# EAGLE design radio_V14.01.09 (EAGLE 5.01)
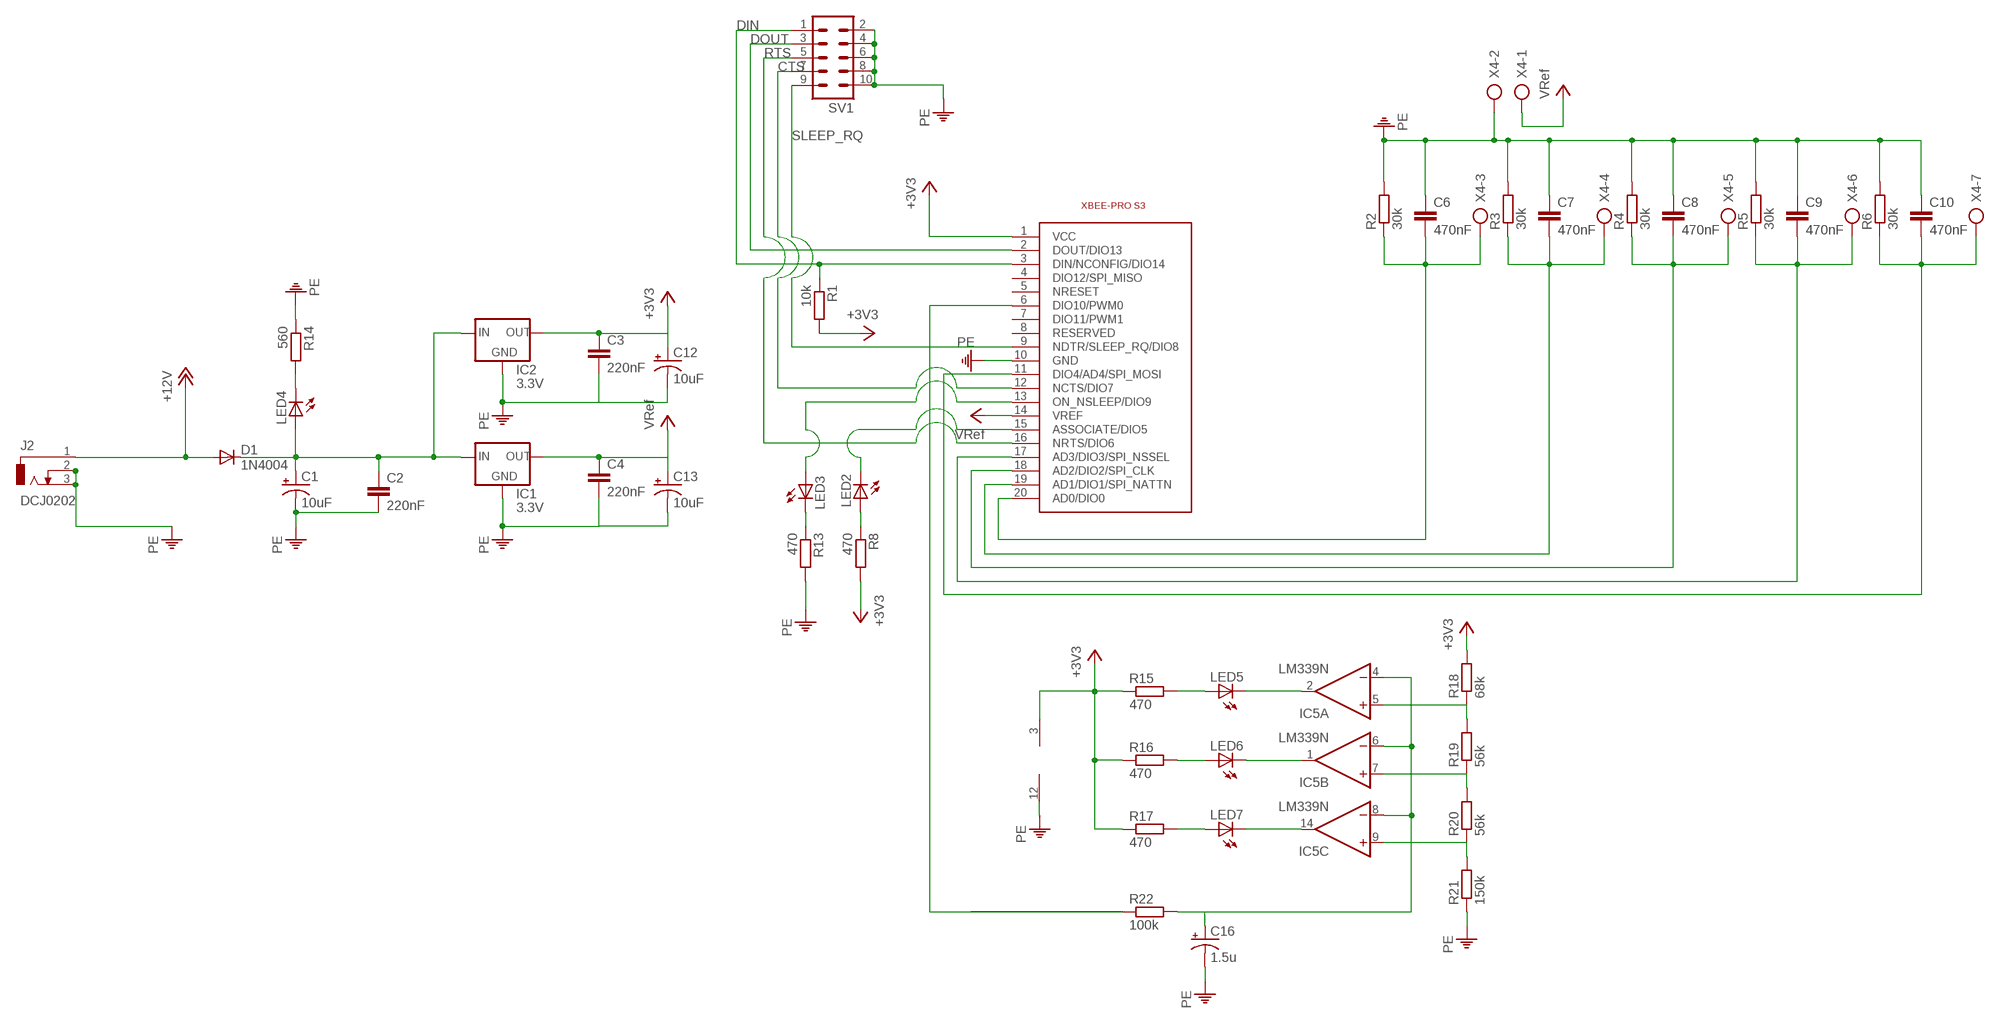
[diagram p0: schematic, sheet 1]

## Parts
C1  10uF  CPOL-USE2-5  [E2-5]
C2  220nF  C5/3.5  [C5B3.5]
C3  220nF  C5/3.5  [C5B3.5]
C4  220nF  C5/3.5  [C5B3.5]
C6  470nF  C5/3.5  [C5B3.5]
C7  470nF  C5/3.5  [C5B3.5]
C8  470nF  C5/3.5  [C5B3.5]
C9  470nF  C5/3.5  [C5B3.5]
C10  470nF  C5/3.5  [C5B3.5]
C12  10uF  CPOL-USE2-5  [E2-5]
C13  10uF  CPOL-USE2-5  [E2-5]
C16  1.5u  CPOL-USE2-5  [E2-5]
D1  1N4004  [DO41-10]
IC1  3.3V  78XXL  [78XXL]
IC2  3.3V  78XXL  [78XXL]
IC5  LM339N  [DIL14]
J2  DCJ0202  [DCJ0202]
LED2  LED3MM  [LED3MM]
LED3  LED3MM  [LED3MM]
LED4  LED5MM  [LED5MM]
LED5  LED3MM  [LED3MM]
LED6  LED3MM  [LED3MM]
LED7  LED3MM  [LED3MM]
R1  10k  R-EU_0207/7  [0207/7]
R2  30k  R-EU_0207/7  [0207/7]
R3  30k  R-EU_0207/7  [0207/7]
R4  30k  R-EU_0207/7  [0207/7]
R5  30k  R-EU_0207/7  [0207/7]
R6  30k  R-EU_0207/7  [0207/7]
R8  470  R-EU_0207/7  [0207/7]
R13  470  R-EU_0207/7  [0207/7]
R14  560  R-EU_0207/7  [0207/7]
R15  470  R-EU_0207/7  [0207/7]
R16  470  R-EU_0207/7  [0207/7]
R17  470  R-EU_0207/7  [0207/7]
R18  68k  R-EU_0207/7  [0207/7]
R19  56k  R-EU_0207/7  [0207/7]
R20  56k  R-EU_0207/7  [0207/7]
R21  150k  R-EU_0207/7  [0207/7]
R22  100k  R-EU_0207/7  [0207/7]
SV1  ML10  [ML10]
U$1  XBEEPRO900  [XBEE-PRO]
X4  AK500/8-H  [AK500/8-H]

## Nets
+3V3: C3.1 C12.+ IC2.OUT IC5.3(P:V+) R1.2 R8.2 R15.1 R16.1 R17.1 R18.2 U$1.1(VCC)
+12V: D1.A J2.1
CTS: SV1.7 U$1.12(NCTS/DIO7)
DIN: R1.1 SV1.1 U$1.3(DIN/NCONFIG/DIO14)
DOUT: SV1.3 U$1.2(DOUT/DIO13)
N$2: C1.+ C2.1 D1.C IC1.IN IC2.IN LED4.A
N$3: C6.2 R2.1 U$1.20(AD0/DIO0) X4.3
N$4: C7.2 R3.1 U$1.19(AD1/DIO1/SPI_NATTN) X4.4
N$5: C8.2 R4.1 U$1.18(AD2/DIO2/SPI_CLK) X4.5
N$6: C9.2 R5.1 U$1.17(AD3/DIO3/SPI_NSSEL) X4.6
N$7: C10.2 R6.1 U$1.11(DIO4/AD4/SPI_MOSI) X4.7
N$8: LED3.A U$1.13(ON_NSLEEP/DIO9)
N$9: R22.1 U$1.6(DIO10/PWM0)
N$11: LED2.A R8.1
N$14: LED3.K(C) R13.1
N$15: LED4.K(C) R14.2
N$16: LED2.K(C) U$1.15(ASSOCIATE/DIO5)
N$24: IC5.2(A:OUT) LED5.K(C)
N$25: IC5.1(B:OUT) LED6.K(C)
N$26: IC5.14(C:OUT) LED7.K(C)
N$27: LED7.A R17.2
N$28: LED6.A R16.2
N$29: LED5.A R15.2
N$30: IC5.5(A:+IN) R18.1 R19.2
N$31: IC5.7(B:+IN) R19.1 R20.2
N$32: IC5.9(C:+IN) R20.1 R21.2
N$33: C16.+ IC5.4(A:-IN) IC5.6(B:-IN) IC5.8(C:-IN) R22.2
PE: C1.- C2.2 C3.2 C4.2 C6.1 C7.1 C8.1 C9.1 C10.1 C12.- C13.- C16.- IC1.GND IC2.GND IC5.12(P:GND) J2.2 J2.3 R2.2 R3.2 R4.2 R5.2 R6.2 R13.2 R14.1 R21.1 SV1.2 SV1.4 SV1.6 SV1.8 SV1.10 U$1.10(GND) X4.2
RTS: SV1.5 U$1.16(NRTS/DIO6)
SLEEP_RQ: SV1.9 U$1.9(NDTR/SLEEP_RQ/DIO8)
VCC: C4.1 C13.+ IC1.OUT U$1.14(VREF) X4.1 ; supply symbol labelled VRef
Unconnected: IC5.10(D:-IN) IC5.11(D:+IN) IC5.13(D:OUT) U$1.4(DIO12/SPI_MISO) U$1.5(NRESET) U$1.7(DIO11/PWM1) U$1.8(RESERVED) X4.8

## Library data of the parts
C1 C12 C13 C16 = rcl:CPOL-US: POLARIZED CAPACITOR, American symbol
C2-C4 C6-C10 = capacitor-wima:C: CAPACITOR naming: grid - package width
D1 = diode:1N4004: DIODE general purpose rectifier, 1 A
IC1 IC2 = v-reg:78XXL: VOLTAGE REGULATOR
IC5 = linear:LM339: Low Power Low Offset Voltage Quad Comparators with open collector; LM139/LM239/LM339/LM2901/LM3302
J2 = con-jack:DCJ0202: DC POWER JACK Source: DCJ0202.pdf
LED2-LED7 = led:LED: LED OSRAM: - CHIPLED LG R971, LG N971, LY N971, LG Q971, LY Q971, LO R971, LY R971 LH N974, LH R974 LS Q976, LO Q976, LY Q976 LO Q996 - Hyper CHIPLED LW Q18S LB Q993, LB Q99A, LB R99A - SideLED LS A670, LO A670, LY A670, LG A670, LP A670 LB A673, LV A673, LT A673, LW A673 LH A674 LY A675 LS A676, LA A676, LO A676, LY A676, LW A676 LS A679, LY A679, LG A679 - Hyper Micro SIDELED® LS Y876, LA Y876, LO Y876, LY Y876 LT Y87S - SmartLED LW L88C, LW L88S LB L89C, LB L89S, LG L890 LS L89K, LO L89K, LY L89K LS L896, LA L896, LO L896, LY L896 - TOPLED LS T670, LO T670, LY T670, LG T670, LP T670 LSG T670, LSP T670, LSY T670, LOP T670, LYG T670 LG T671, LOG T671, LSG T671 LB T673, LV T673, LT T673, LW T673 LH T674 LS T676, LA T676, LO T676, LY T676, LB T676, LH T676, LSB T676, LW T676 LB T67C, LV T67C, LT T67C, LS T67K, LO T67K, LY T67K, LW E67C LS E67B, LA E67B, LO E67B, LY E67B, LB E67C, LV E67C, LT E67C LW T67C LS T679, LY T679, LG T679 LS T770, LO T770, LY T770, LG T770, LP T770 LB T773, LV T773, LT T773, LW T773 LH T774 LS E675, LA E675, LY E675, LS T675 LS T776, LA T776, LO T776, LY T776, LB T776 LHGB T686 LT T68C, LB T68C - Hyper Mini TOPLED® LB M676 - Mini TOPLED Santana® LG M470 LS M47K, LO M47K, LY M47K Source: http://www.osram.convergy.de - LUMILED® LXK2-PW12-R00, LXK2-PW12-S00, LXK2-PW14-U00, LXK2-PW14-V00 LXK2-PM12-R00, LXK2-PM12-S00, LXK2-PM14-U00 LXK2-PE12-Q00, LXK2-PE12-R00, LXK2-PE12-S00, LXK2-PE14-T00, LXK2-PE14-U00 LXK2-PB12-K00, LXK2-PB12-L00, LXK2-PB12-M00, LXK2-PB14-N00, LXK2-PB14-P00, LXK2-PB14-Q00 LXK2-PR12-L00, LXK2-PR12-M00, LXK2-PR14-Q00, LXK2-PR14-R00 LXK2-PD12-Q00, LXK2-PD12-R00, LXK2-PD12-S00 LXK2-PH12-R00, LXK2-PH12-S00 LXK2-PL12-P00, LXK2-PL12-Q00, LXK2-PL12-R00 Source: www.luxeon.com
R1-R6 R8 R13-R22 = resistor:R-EU_: RESISTOR, European symbol
SV1 = con-harting-ml:ML10: HARTING
U$1 = maxstream2:XBEEPRO900
X4 = con-ptr500:AK500/8-H: CONNECTOR Aug. 2004 / PTR Meßtechnik: Die Bezeichnung der Serie AK505 wurde geändert. Es handelt sich hierbei um AK500 in horizontaler Ausführung.

## Board
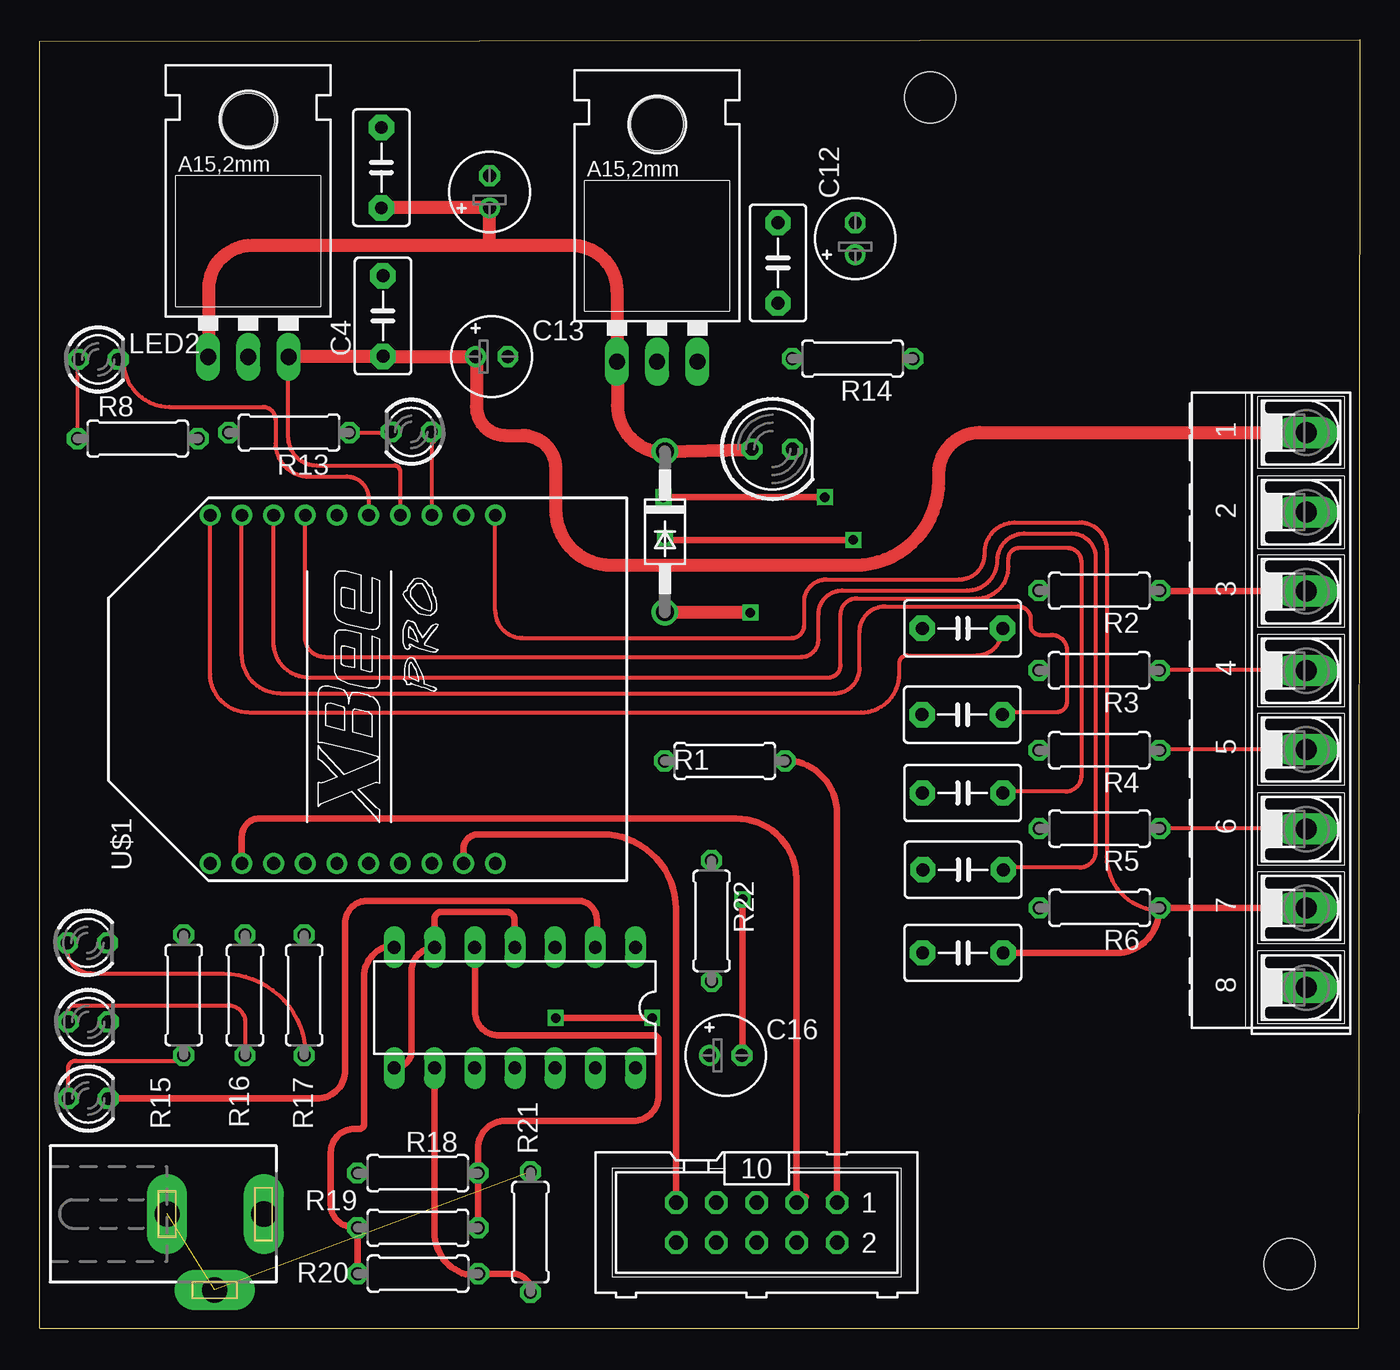
[diagram p1: board, top side]
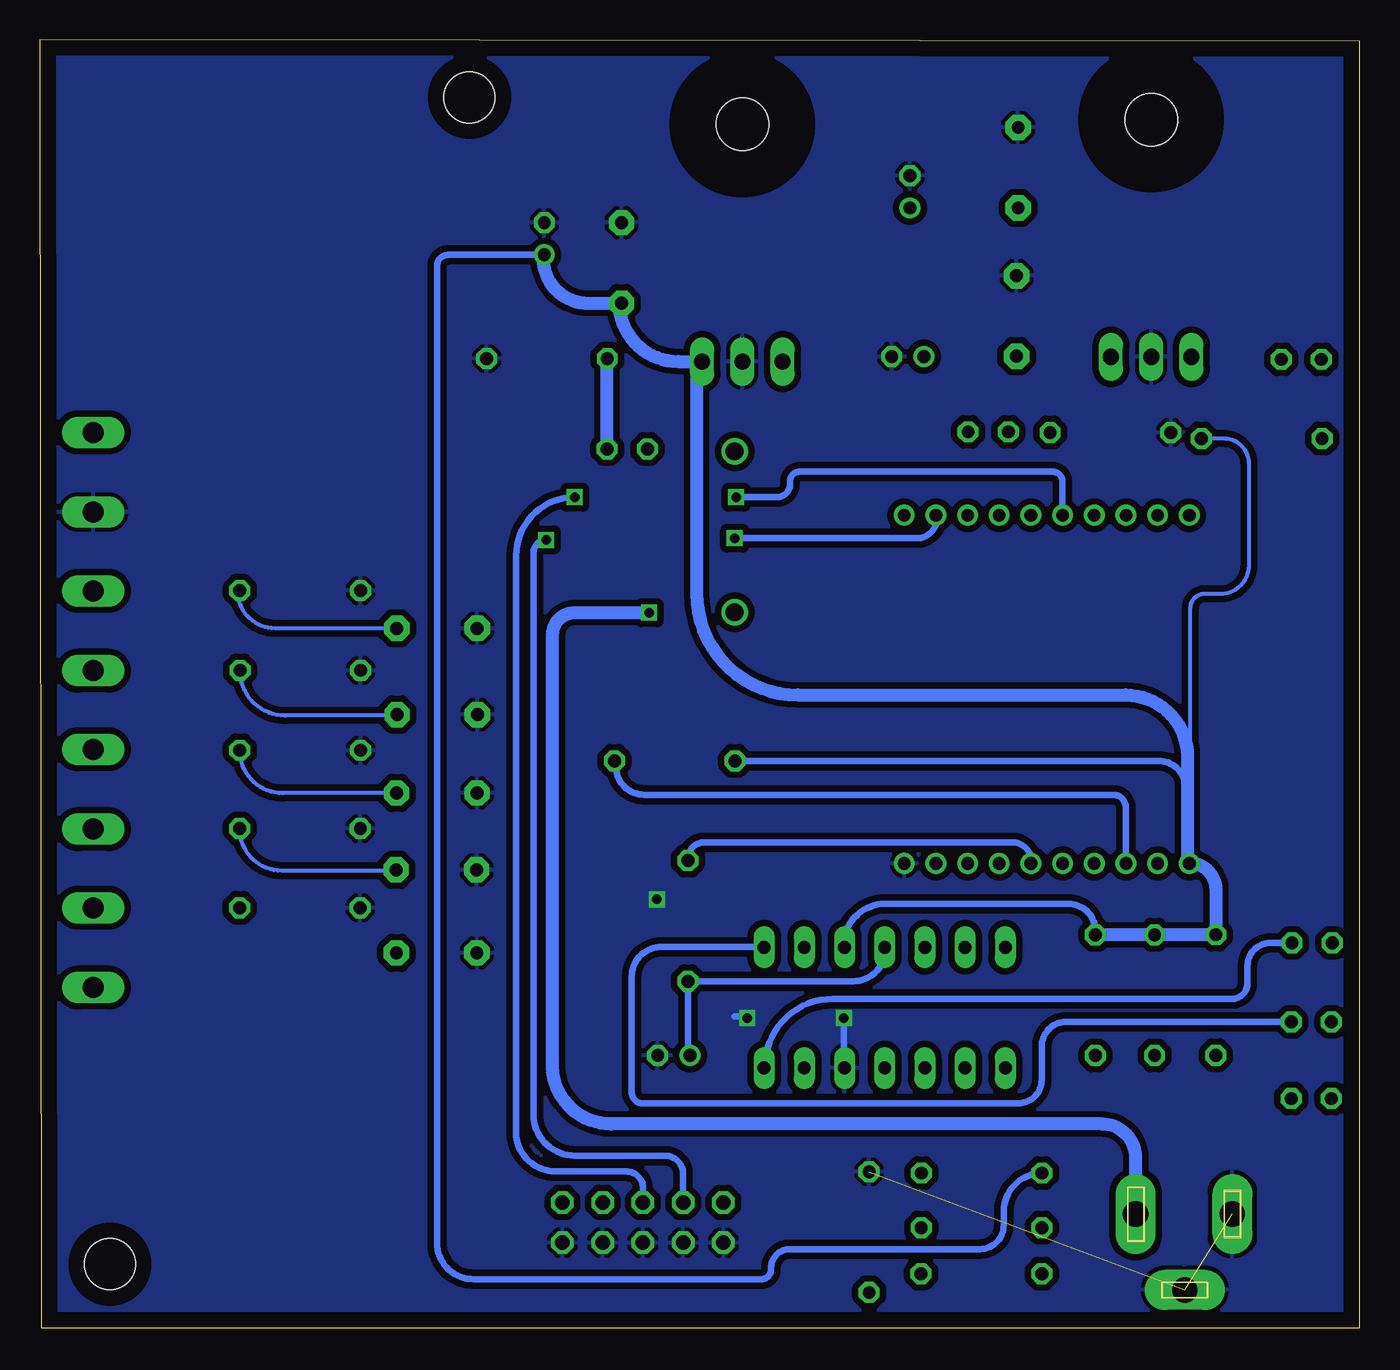
[diagram p2: board, bottom side, seen from below]

Size 83.4 x 81.4 mm. Coordinates in mm from the lower left corner, seen from the top.
Outline: 0,0 0,81.3 83.4,81.4 83.3,0 0,0
Outline: 7.5,8.7 8.6,8.7 8.6,5.7 7.5,5.7 7.5,8.7
Outline: 13.6,8.9 14.7,8.9 14.7,5.5 13.6,5.5 13.6,8.9
Outline: 9.6,1.9 12.5,1.9 12.5,2.9 9.6,2.9 9.6,1.9
Copper layers (1*16): Top 0.035mm / dielectric 1.5mm / Bottom 0.035mm
Design rules "default": minimum track width 10mil, minimum drill 24mil, track to track 8mil, track to pad 8mil, pad to pad 8mil, via to via 8mil, smd to smd 8mil, copper to edge 40mil, drill to drill 8mil, minimum pad ring 10mil, minimum via ring 8mil, stop-mask expansion 4mil, vias tented up to drill 0mil, thermal gap 10mil
Holes 3.2 mm at 78.95,4.05 56.25,77.75

### Footprints (pad centres in the part's own frame; a part is rotated, then mirrored left to right if it is on the bottom)
E2-5 = drill 0.813 pad 1.27 round: + -1.016,0 | drill 0.813 pad 1.27 octagon: - 1.016,0
C5B3.5 = drill 0.813 pad 1.6 octagon: 1 -2.54,0; 2 2.54,0
DO41-10 = drill 1.118 round: A 5.08,0; C -5.08,0
78XXL = drill 1.016 long: GND 0,-3.81; IN -2.54,-3.81; OUT 2.54,-3.81 | hole 3.302: 0,11.176
DIL14 = drill 0.813 long: 1 -7.62,-3.81; 2 -5.08,-3.81; 3 -2.54,-3.81; 4 0,-3.81; 5 2.54,-3.81; 6 5.08,-3.81; 7 7.62,-3.81; 8 7.62,3.81; 9 5.08,3.81; 10 2.54,3.81; 11 0,3.81; 12 -2.54,3.81; 13 -5.08,3.81; 14 -7.62,3.81
DCJ0202 = drill 1.6 pad 2.54 long: 1 0,3.1; 2 4.8,0; 3 0,-3
LED3MM = drill 0.813 octagon: A -1.27,0; K 1.27,0
LED5MM = drill 0.813 octagon: A -1.27,0; K 1.27,0
0207/7 = drill 0.813 octagon: 1 -3.81,0; 2 3.81,0
ML10 = drill 0.914 octagon: 1 -5.08,-1.27; 2 -5.08,1.27; 3 -2.54,-1.27; 4 -2.54,1.27; 5 0,-1.27; 6 0,1.27; 7 2.54,-1.27; 8 2.54,1.27; 9 5.08,-1.27; 10 5.08,1.27
XBEE-PRO = drill 0.8 pad 1.27 round: 1 -11,9; 2 -11,7; 3 -11,5; 4 -11,3; 5 -11,1; 6 -11,-1; 7 -11,-3; 8 -11,-5; 9 -11,-7; 10 -11,-9; 11 11,-9; 12 11,-7; 13 11,-5; 14 11,-3; 15 11,-1; 16 11,1; 17 11,3; 18 11,5; 19 11,7; 20 11,9
AK500/8-H = drill 1.321 long: 1 -17.526,0; 2 -12.497,0; 3 -7.518,0; 4 -2.489,0; 5 2.489,0; 6 7.518,0; 7 12.497,0; 8 17.526,0

### Placement (x,y rotation side)
C1  28.42,71.78 90 top
C2  21.59,73.31 90 top
C3  46.64,67.29 90 top
C4  21.69,63.94 90 top
C6  58.3,44.21 0 top
C7  58.28,38.76 0 top
C8  58.31,33.81 0 top
C9  58.34,28.96 0 top
C10  58.32,23.71 0 top
C12  51.52,68.82 90 top
C13  28.56,61.38 0 top
C16  43.34,17.23 0 top
D1  39.5,50.31 270 top
IC1  13.18,65.17 0 top
IC2  39.01,64.87 0 top
IC5  30.02,20.25 180 top
J2  11.06,7.22 270 top
LED2  3.7,61.2 0 top
LED3  23.48,56.62 180 top
LED4  46.28,55.54 0 top
LED5  3.07,14.51 0 top
LED6  3.07,19.35 0 top
LED7  3.02,24.34 0 top
R1  43.28,35.84 180 top
R2  66.94,46.59 180 top
R3  66.93,41.56 180 top
R4  66.94,36.51 180 top
R5  66.95,31.56 180 top
R6  66.96,26.56 180 top
R8  6.2,56.2 0 top
R13  15.76,56.58 180 top
R14  51.35,61.25 180 top
R15  9.1,21.05 270 top
R16  12.97,21.04 270 top
R17  16.71,21.04 270 top
R18  23.89,9.8 180 top
R19  23.9,6.35 0 top
R20  23.91,3.45 180 top
R21  31,6.07 270 top
R22  42.45,25.73 270 top
SV1  45.29,6.67 180 top
U$1  19.78,40.36 90 top
X4  80.01,39.05 270 top

### Tracks (layer width: path | path; a pad name or v marks a point on that pad's centre or on a via)
+3V3
  Bottom 0.254: 10.7,29.2 10.7,45.5 arc90 9.8,46.4 8.8,46.4 arc-90 7,48.2 7,54.6 arc-90 8.6,56.2 R8.2
  Bottom 0.406: R17.1 16.71,25.11 arc-90 18.4,26.8 30,26.8 arc-90 32.6,24.2 arc90 32.56,24.16 IC5.3 | 10.9,34.1 11,34.1 arc-90 12.74,35.84 R1.2 | R18.2 arc-90 22.5,7.38 22.5,6.5 arc90 24,5 36,5 arc-90 37.2,3.8 37.2,3.7 arc90 37.8,3.1 56,3.1 arc90 58.3,5.4 58.3,67.1 arc90 57.6,67.8 51.8,67.8 arc90 51.5,67.5 arc90 51.52,67.52 C12.+
  Bottom 0.813: C12.+ 51.52,67.68 arc90 51.6,67.6 arc-90 48.75,64.75 C3.1 46.75,64.75 arc90 46.8,64.8 arc-90 43.06,61.06 IC2.OUT 41.55,60.95 arc90 41.6,60.9 arc-90 41.9,60.6 41.9,46.4 arc-90 35.5,40 14.8,40 arc90 10.9,36.1 10.9,34.1 10.9,29.4 arc-90 10.7,29.2 arc90 10.78,29.28 U$1.1 10.78,29.38 arc-90 10.8,29.4 arc90 9.1,27.7 R15.1 13.06,24.86 arc90 13.1,24.9 arc-90 13.05,24.85 R16.1 16.65,24.85 arc90 16.7,24.9 arc-90 16.71,24.89 R17.1
+12V  (via drill 0.6)
  Top 0.813: D1.A 39.47,45.23 arc-90 39.4,45.3 arc90 39.5,45.2 v44.9,45.2
  Bottom 0.813: J2.1 14.16,10.76 arc-90 16.3,12.9 47.3,12.9 arc90 51,16.6 51,43.8 arc90 49.6,45.2 v44.9,45.2
CTS  (via drill 0.6)
  Top 0.406: v51.4,49.8 39.6,49.8 arc-90 v39.5,49.9
  Bottom 0.406: SV1.7 42.75,9.75 arc-90 43.9,10.9 49.6,10.9 arc90 52.2,13.5 52.2,49 arc90 v51.4,49.8 | U$1.12 26.78,51.28 arc-90 26.7,51.2 arc90 28,49.9 v39.5,49.9
DIN
  Top 0.406: R1.1 47.06,35.84 arc-90 47,35.9 arc-90 50.37,32.53 SV1.1
  Bottom 0.406: U$1.3 14.78,32.88 arc-90 15.6,33.7 45.2,33.7 arc90 47,35.5 arc90 47.09,35.59 R1.1
DOUT
  Top 0.406: U$1.2 12.78,31.08 arc-90 13.9,32.2 44,32.2 arc-90 47.8,28.4 47.8,8.9 arc90 48.4,8.3 48.2,8.3 arc90 47.8,7.9 arc90 SV1.3
N$2
  Top 0.813: 28.4,68.4 13.4,68.4 arc90 10.7,65.7 10.7,61.4 arc-90 10.66,61.36 IC1.IN | 28.4,68.4 33.6,68.4 arc-90 36.47,65.53 IC2.IN IC2.IN arc90 36.4,61 arc-90 36.5,60.9 36.5,58.3 arc90 39.5,55.3 D1.C 44.79,55.49 arc90 45,55.7 arc-90 45.01,55.69 LED4.A | C2.1 28.33,70.77 arc-90 28.4,70.7 arc90 28.42,70.72 C1.+ 28.42,68.52 arc-90 28.4,68.5 28.4,68.4
N$3
  Top 0.254: U$1.20 10.78,41.32 arc90 13.2,38.9 51.9,38.9 arc90 54.3,41.3 54.3,42 arc-90 54.8,42.5 59.2,42.5 arc90 60.8,44.1 arc90 60.84,44.14 C6.2
  Top 0.406: R2.1 70.75,46.65 arc-90 70.8,46.7 arc90 70.93,46.57 X4.3
  Bottom 0.254: R2.1 70.89,46.59 arc90 70.9,46.6 arc-90 68.51,44.21 C6.2
N$4
  Top 0.254: U$1.19 12.78,42.52 arc90 15.2,40.1 50.2,40.1 arc90 51.8,41.7 51.8,44 arc-90 53.4,45.6 61.8,45.6 arc-90 62.6,44.8 62.6,44.4 arc90 63.2,43.8 63.9,43.8 arc-90 64.9,42.8 64.9,39.6 arc-90 64.2,38.9 61,38.9 arc90 60.8,38.7 arc90 60.82,38.72 C7.2 | X4.4 arc-90 X4.4 80,41.6 70.78,41.6 arc90 R3.1
  Bottom 0.254: C7.2 arc90 60.8,38.74 60.8,38.7 67.88,38.7 arc90 R3.1
N$5
  Top 0.254: U$1.18 14.78,43.32 arc90 17,41.1 49.8,41.1 arc90 50.6,41.9 50.6,45.1 arc-90 51.6,46.1 59.2,46.1 arc90 61.2,48.1 61.2,48.6 arc-90 61.9,49.3 64.9,49.3 arc-90 65.8,48.4 65.8,34.9 arc-90 64.8,33.9 61,33.9 arc90 60.9,33.8 arc90 60.89,33.81 C8.2 | 80.05,36.6 80.1,36.6 | 80.05,36.6 arc90 X4.5 | R4.1 arc-90 70.84,36.6 80.05,36.6
  Bottom 0.254: C8.2 arc90 C8.2 68.04,33.8 arc90 R4.1
N$6
  Top 0.254: U$1.17 16.78,43.62 arc90 18,42.4 48.1,42.4 arc90 49.2,43.5 49.2,45.1 arc-90 50.7,46.6 58.6,46.6 arc90 60.5,48.5 arc-90 62.2,50.2 65.2,50.2 arc-90 66.7,48.7 66.7,30.1 arc-90 65.7,29.1 61,29.1 arc90 60.8,28.9 arc-90 60.86,28.96 C9.2 | 80.08,31.6 80.1,31.6 | 80.08,31.6 arc90 X4.6 | R5.1 arc-90 70.8,31.6 80.08,31.6
  Bottom 0.254: 60.82,28.9 60.8,28.9 | C9.2 arc-90 60.82,28.9 | R5.1 arc-90 68.1,28.9 60.82,28.9
N$7
  Top 0.254: U$1.11 28.78,45.32 arc90 30.5,43.6 47.5,43.6 arc90 48.3,44.4 48.3,45.9 arc-90 49.7,47.3 58.1,47.3 arc90 59.7,48.9 59.7,49 arc-90 61.6,50.9 65.7,50.9 arc-90 67.4,49.2 67.4,29.8 arc90 70.8,26.4 arc-90 70.77,26.43 R6.1
  Top 0.406: X4.7 70.75,26.55 arc90 70.7,26.5 arc-90 R6.1 70.77,26.47 arc-90 70.7,26.4 arc-90 68.01,23.71 C10.2
N$8
  Top 0.254: LED3.A 24.85,55.95 arc-90 24.9,56 arc90 24.78,55.88 U$1.13
N$9
  Bottom 0.406: R22.1 42.45,29.65 arc90 41.4,30.7 22,30.7 arc90 20.7,29.4 arc90 20.74,29.36 U$1.6
N$11
  Top 0.254: LED2.A 2.4,61.2 R8.1
N$14
  Top 0.254: LED3.K 22.38,56.62 arc-90 22.4,56.6 arc-90 22.38,56.58 R13.1
N$15
  Bottom 0.813: R14.2 arc90 47.6,61.3 arc90 R14.2 | R14.2 | LED4.K R14.2
N$16
  Top 0.254: U$1.15 20.78,52.42 arc90 19.4,53.8 17,53.8 arc-90 14.9,55.9 14.9,57.4 arc90 14.1,58.2 8.2,58.2 arc-90 5.3,61.1 arc90 5.2,61.2 LED2.K
N$24
  Top 0.406: LED5.K 17.51,14.51 arc90 19.3,16.3 19.3,25.6 arc-90 20.7,27 34,27 arc-90 35.2,25.8 35.2,24.1 arc90 35.3,24 arc90 35.24,24.06 IC5.2
N$25
  Bottom 0.406: LED6.K 18.55,19.35 arc-90 20.1,17.8 20.1,15.7 arc90 21.6,14.2 45.3,14.2 arc90 46,14.9 46,22.2 arc90 44.1,24.1 37.8,24.1 arc-90 37.76,24.06 IC5.1
N$26
  Bottom 0.406: LED7.K 5.66,24.34 arc-90 7.1,22.9 7.1,21.8 arc90 8.1,20.8 33.3,20.8 arc-90 37.6,16.5 arc-90 37.64,16.46 IC5.14
N$27
  Top 0.254: LED7.A 1.75,23.95 arc90 3.3,22.4 11.6,22.4 arc-90 16.8,17.2 arc90 16.77,17.23 R17.2
N$28
  Top 0.254: LED6.A 1.8,20 arc-90 2.2,20.4 11.9,20.4 arc-90 13,19.3 13,17.3 arc90 12.97,17.27 R16.2
N$29
  Top 0.254: LED5.A 1.8,16.4 arc-90 2.3,16.9 8.7,16.9 arc90 9.1,17.3 R15.2
N$30
  Top 0.406: R19.2 27.71,9.71 arc-90 27.8,9.8 R18.1 27.7,11.4 arc-90 29.4,13.1 37.5,13.1 arc90 39.1,14.7 39.1,18.2 arc90 38.8,18.5 29,18.5 arc-90 27.5,20 27.5,24.04 arc90 IC5.5 27.46,24.06 arc90 27.4,24
N$31
  Top 0.406: 20.1,6.4 arc90 20.09,6.39 | 20.09,6.39 arc-90 20.2,6.5 arc90 20.1,6.4 | 20.09,6.39 R19.1 | R20.2 20.1,6.4 | 20.1,6.4 19.8,6.4 arc-90 18.4,7.8 18.4,11.1 arc-90 19.9,12.6 20.2,12.6 arc90 20.5,12.9 20.5,22.2 arc-90 22.5,24.2 arc90 22.4,24.1 IC5.7
N$32
  Top 0.406: IC5.9 24.94,6.06 arc90 27.7,3.3 arc90 27.72,3.32 R20.1 29.85,3.45 arc-90 31.1,2.2 arc90 31.04,2.26 R21.2
N$33
  Top 0.406: IC5.8 arc90 23.5,17.54 23.5,22.6 arc-90 24.9,24 arc90 24.94,24.04 IC5.6 24.94,25.84 arc-90 25.4,26.3 29.5,26.3 arc-90 30,25.8 30,24.2 arc90 30.2,24 arc90 30.14,24.06 IC5.4
  Bottom 0.406: IC5.4 30.02,23.92 arc-90 30,23.9 arc90 31.98,21.92 R22.2 42.45,17.55 arc-90 42.3,17.4 arc-90 42.32,17.38 C16.+
PE  (via drill 0.6)  (2 unrouted)
  Top 0.254: C16.- arc90 44.4,17.27
  Top 0.406: v32.6,19.6 v38.7,19.6 | 44.4,17.27 v44.4,27.1
  Bottom 0.254: v44.4,27.1 44.4,27.2
  Bottom 0.406: IC5.12 arc90 32.6,16.48 v32.6,19.6 | v38.7,19.6 arc-90 38.8,19.7 39.5,19.7
  pour Bottom (isolate 0.406): 0.2,81 82.9,81 82.9,0.4 0.2,0.4
RTS  (via drill 0.6)
  Top 0.406: v49.6,52.5 v39.4,52.5
  Bottom 0.406: SV1.5 45.29,8.89 arc-90 46.3,9.9 50.8,9.9 arc90 53.3,12.4 53.3,48.8 arc90 v49.6,52.5 | v39.4,52.5 36.8,52.5 arc-90 36,53.3 36,53.5 arc90 35.4,54.1 19.4,54.1 arc90 18.8,53.5 18.8,51.38 arc-90 U$1.16
SLEEP_RQ
  Top 0.406: U$1.9 26.78,30.28 arc-90 27.7,31.2 35.5,31.2 arc-90 40.2,26.5 40.2,7.9 arc90 40.21,7.91 SV1.9
VCC
  Top 0.254: U$1.14 22.78,54.12 arc90 22.4,54.5 17.5,54.5 arc-90 15.7,56.3 15.7,61.3 arc90 15.72,61.32 IC1.OUT
  Top 0.813: X4.1 59.38,56.58 arc90 56.8,54 56.8,53.5 arc-90 51.5,48.2 36.1,48.2 arc-90 32.6,51.7 32.6,54.3 arc90 30.5,56.4 29.4,56.4 arc-90 27.6,58.2 27.6,61.2 arc-90 27.54,61.26 C13.+ 21.72,61.38 arc-90 C4.1 15.9,61.4 arc-90 15.86,61.36 IC1.OUT